# EAGLE design 5v dc (EAGLE 9.6.2)
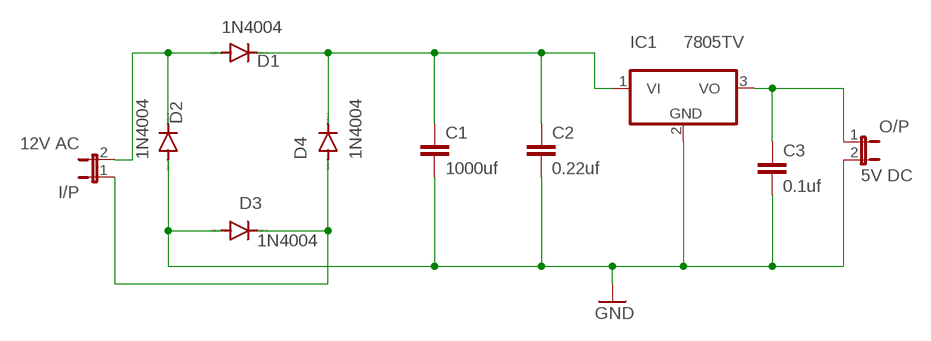
[diagram p0: schematic, sheet 1]

## Parts
C1  1000uf  C2,5-3  [C2.5-3]
C2  0.22uf  C2,5-3  [C2.5-3]
C3  0.1uf  C2,5-3  [C2.5-3]
D1  1N4004  [DO41-10]
D2  1N4004  [DO41-10]
D3  1N4004  [DO41-10]
D4  1N4004  [DO41-10]
I/P  12V AC  JP1E  [JP1]
IC1  7805TV  [TO220V]
O/P  5V DC  JP1E  [JP1]

## Nets
GND: C1.2 C2.2 C3.2 D2.A D3.A IC1.2(GND) O/P.2
N$1: D1.A D2.C I/P.2
N$4: D3.C D4.A I/P.1
N$5: C1.1 C2.1 D1.C D4.C IC1.1(VI)
N$6: C3.1 IC1.3(VO) O/P.1

## Library data of the parts
C1-C3 = capacitor-wima:C: CAPACITOR naming: grid - package width
D1-D4 = diode:1N4004: DIODE general purpose rectifier, 1 A
I/P O/P = jumper:JP1E: JUMPER
IC1 = linear:78*: Positive VOLTAGE REGULATOR Source: http://cache.national.com/ds/LM/LM78L05.pdf http://www.fairchildsemi.com/ds/LM/LM7805.pdf

## Board
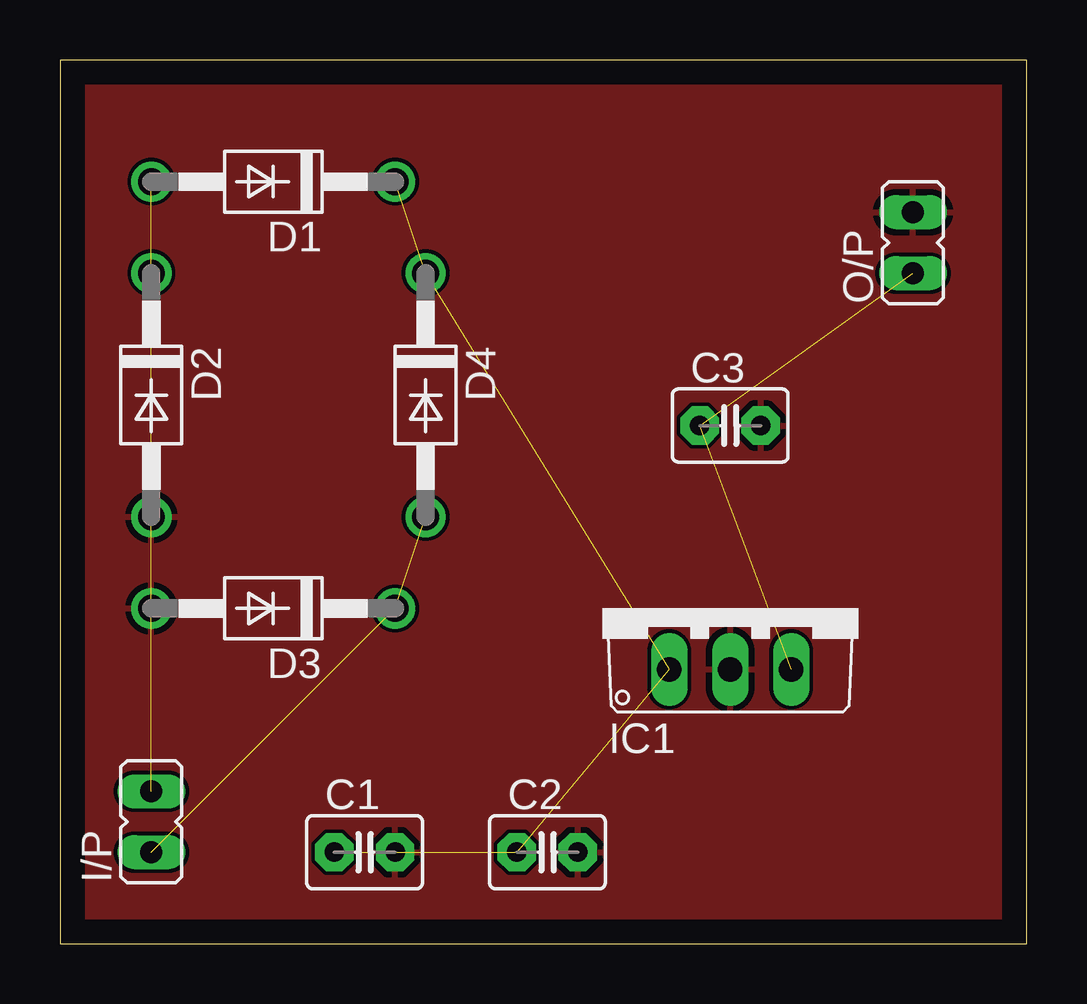
[diagram p1: board, top side]
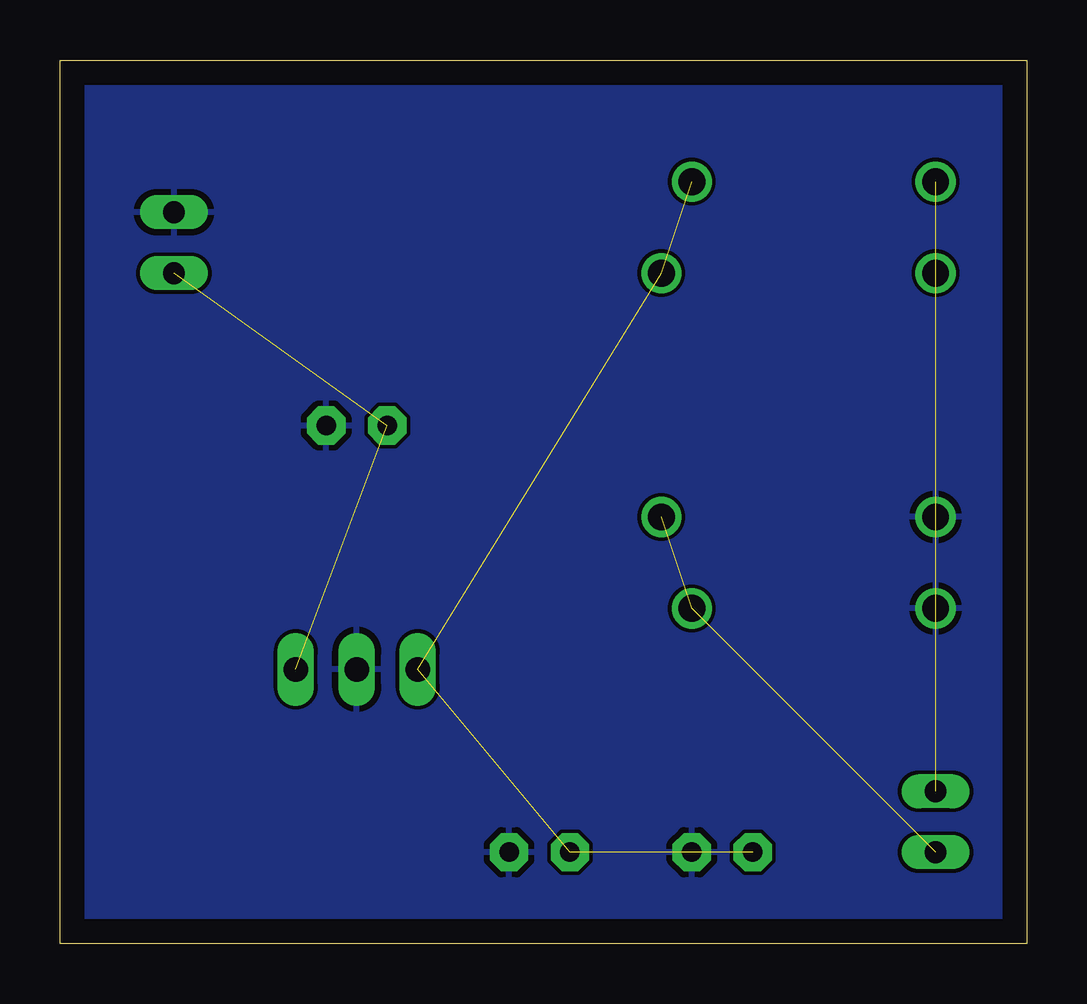
[diagram p2: board, bottom side, seen from below]

Size 40.31 x 36.82 mm. Coordinates in mm from the lower left corner, seen from the top.
Outline: 0,0 40.31,0 40.31,36.82 0,36.82 0,0
Copper layers (1*16): Top 0.035mm / dielectric 1.5mm / Bottom 0.035mm
Design rules "default": minimum track width 6mil, minimum drill 0.35mm, track to track 6mil, track to pad 6mil, pad to pad 6mil, via to via 6mil, smd to smd 6mil, copper to edge 40mil, drill to drill 6mil, minimum pad ring 10mil, minimum via ring 8mil, stop-mask expansion 4mil, vias tented up to drill 0mil, thermal gap 10mil

### Footprints (pad centres in the part's own frame; a part is rotated, then mirrored left to right if it is on the bottom)
C2.5-3 = drill 0.813 pad 1.6 octagon: 1 -1.27,0; 2 1.27,0
DO41-10 = drill 1.118: A 5.08,0; C -5.08,0
JP1 = drill 0.914 long: 1 0,-1.27; 2 0,1.27
TO220V = drill 1.016 long: 1 -2.54,-2.54; 2 0,-2.54; 3 2.54,-2.54

### Placement (x,y rotation side)
C1  12.7,3.81 0 top
C2  20.32,3.81 0 top
C3  27.94,21.59 0 top
D1  8.89,31.75 180 top
D2  3.81,22.86 270 top
D3  8.89,13.97 180 top
D4  15.24,22.86 270 top
I/P  3.81,5.08 0 top
IC1  27.94,13.97 0 top
O/P  35.56,29.21 0 top

### Tracks (layer width: path | path; a pad name or v marks a point on that pad's centre or on a via)
GND
  pour Top: -3.81,41.91 46.99,41.91 46.99,-3.81 -3.81,-3.81
  pour Bottom: -5.08,44.45 50.8,44.45 50.8,-5.08 -7.62,-5.08 -7.62,-3.81 -7.62,44.45
N$1  (2 unrouted)
N$4  (2 unrouted)
N$5  (4 unrouted)
N$6  (2 unrouted)